# Altium schematic sheet TEMPLATE_Circuit.SchDoc
size Tabloid; Date: Date; Author: Author 1; Revision: 1; SheetNumber: 1; SheetTotal: 3; Size: 11x17; Sheet_Name: Circuit
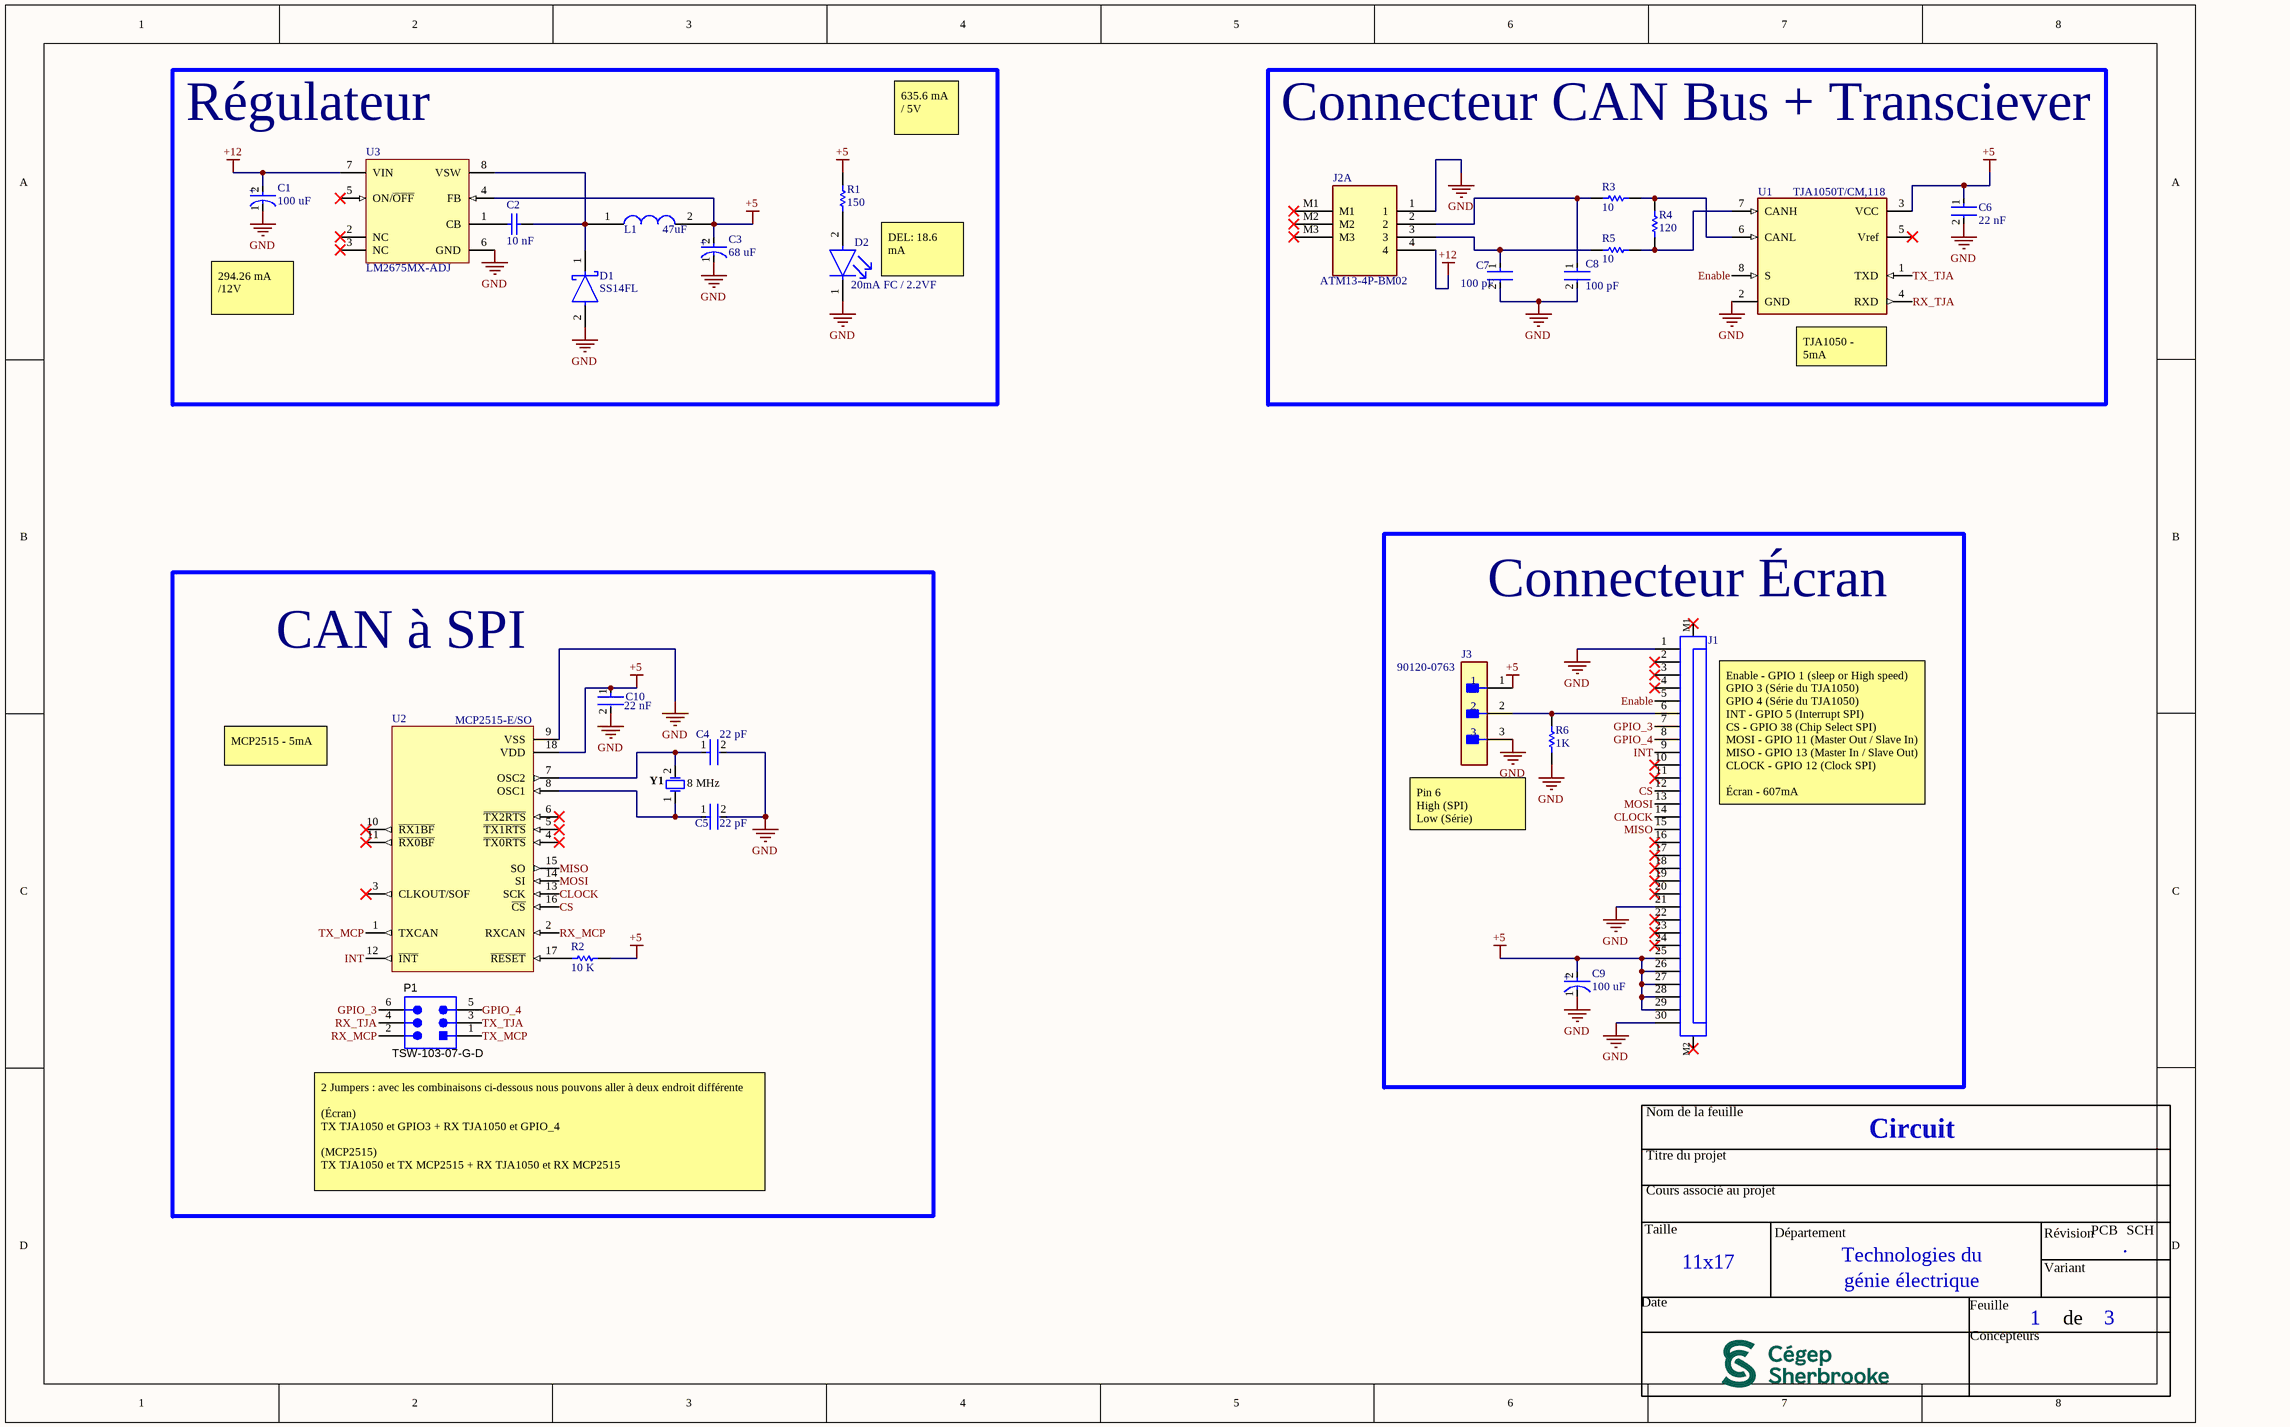
[diagram p0: TEMPLATE_Circuit.SchDoc]

## Parts
C1  100 uF  [FP-FKF-MFG]
C2  10 nF  [CAPC1608X90X35ML10T15]
C3  68 uF  [FP-OS-CON-SMT-F12-MFG]
C4  22 pF  [FP-C0805C-DN-MFG]
C5  22 pF  [FP-C0805C-DN-MFG]
C6  22 nF  [FP-C0805C-DN-MFG]
C7  100 pF  [FP-CC0805-0_1-0_7-IPC_A]
C8  100 pF  [FP-CC0805-0_1-0_7-IPC_A]
C9  100 uF  [FP-FKF-MFG]
C10  22 nF  [FP-C0805C-DN-MFG]
D1  SS14FL  [FP-425AD-MFG]
D2  20mA FC / 2.2VF  [FP-SML-210-MFG]
J1  68613014422  [68613014422]  (value not drawn)
J2  ATM13-4P-BM02  [ATM134PBM02]  (part A of 2)
J3  90120-0763  [FP-90120-0763-MFG]
L1  47uF  [NPI31W470MTRF]
P1  TSW-103-07-G-D  [SMTC-TSW-103-07-G-D_V]
R1  150  [RESC2013X60X40NL20T25]
R2  10 K  [RESC2013X60X35NL10T20]
R3  10  [RESC2013X50X30NL20T20]
R4  120  [RESC2013X60X40ML20T25]
R5  10  [RESC2013X50X30NL20T20]
R6  1K  [RESC2013X60X35ML10T20]
U1  TJA1050T/CM,118  [FP-SOT96-1-IPC_A]
U2  MCP2515-E/SO  [SOIC-SO18_M]
U3  LM2675MX-ADJ  [D0008A_N]
Y1  8 MHz  [FOX-HC49SDLF_V]

## Blocks framed on the sheet
Régulateur: C1-C3 D1 D2 L1 R1 U3
Connecteur CAN Bus + Transciever: C6-C8 J2 R3-R5 U1
Connecteur Écran: C9 J1 J3 R6
CAN à SPI: C4 C5 C10 P1 R2 U2 Y1

## Nets
+5: C3.2(A) C6.1 C9.2(A) C10.1 J1.25 J1.26 J1.27 J1.28 J1.29 J3.1 L1.2 R1.2 R2.2 U1.3(VCC) U2.18(VDD) U3.4(FB)
+12: C1.2(A) J2.4 U3.7(VIN)
GND: C1.1(C) C3.1(C) C4.2 C5.2 C6.2 C7.2 C8.2 C9.1(C) C10.2 D1.2(A) D2.1(C) J1.1 J1.21 J1.30 J2.1 J3.3 R6.1 U1.2(GND) U2.9(VSS) U3.6(GND)
CLOCK: J1.14 U2.13(SCK)
CS: J1.12 U2.16(~{CS})
Enable: J1.5 U1.8(S)
GPIO_3: J1.7 P1.6
GPIO_4: J1.8 P1.5
INT: J1.9 U2.12(~{INT})
MISO: J1.15 U2.15(SO)
MOSI: J1.13 U2.14(SI)
RX_MCP: P1.2 U2.2(RXCAN)
RX_TJA: P1.4 U1.4(RXD)
TX_MCP: P1.1 U2.1(TXCAN)
TX_TJA: P1.3 U1.1(TXD)
NetC2_1: C2.1 U3.1(CB)
NetC2_2: C2.2 D1.1(C) L1.1 U3.8(VSW)
NetC4_1: C4.1 U2.7(OSC2) Y1.2
NetC5_1: C5.1 U2.8(OSC1) Y1.1
NetC7_1: C7.1 J2.3 R5.1
NetC8_1: C8.1 J2.2 R3.1
NetD2_2: D2.2(A) R1.1
NetJ1_6: J1.6 J3.2 R6.2
NetR2_1: R2.1 U2.17(~{RESET})
NetR3_2: R3.2 R4.2 U1.6(CANL)
NetR4_1: R4.1 R5.2 U1.7(CANH)

Not connected (* = marked no-connect by the designer): J1 2* 3* 4* 10* 11* 16* 17* 18* 19* 20* 22* 23* 24* M1* M2*; J2 M1* M2* M3*; U1 5(Vref)*; U2 3(CLKOUT/SOF)* 4(~{TX0RTS})* 5(~{TX1RTS})* 6(~{TX2RTS})* 10(~{RX1BF})* 11(~{RX0BF})*; U3 2(NC)* 3(NC)* 5(ON/~{OFF})*

## Notes on the sheet
- 635.6 mA / 5V
- DEL: 18.6 mA
- 294.26 mA /12V
- (near U1) TJA1050 - 5mA
- MCP2515 - 5mA
- (near J1) Enable - GPIO 1 (sleep or High speed)
  GPIO 3 (Série du TJA1050)
  GPIO 4 (Série du TJA1050)
  INT - GPIO 5 (Interrupt SPI)
  CS - GPIO 38 (Chip Select SPI)
  MOSI - GPIO 11 (Master Out / Slave In)
  MISO - GPIO 13 (Master In / Slave Out)
  CLOCK - GPIO 12 (Clock SPI)
  Écran - 607mA
- Pin 6
  High (SPI)
  Low (Série)
- (near P1) 2 Jumpers : avec les combinaisons ci-dessous nous pouvons aller à deux endroit différente
  (Écran)
  TX TJA1050 et GPIO3 + RX TJA1050 et GPIO_4
  (MCP2515)
  TX TJA1050 et TX MCP2515 + RX TJA1050 et RX MCP2515
- Nom de la feuille
- Titre du projet
- Cours associé au projet
- Taille
- Département
- Technologies du
- Révision
- PCB
- .
- SCH
- Date
- génie électrique
- Feuille
- Variant
- de
- Concepteurs
- (in symbol CMP-2000-06208-3) +
- (in symbol CMP-05428-000631-1) +

## Library data of the parts
C1 C9 = CMP-2000-06208-3: CAP ALUM 100UF 20% 50V SMD; Leakage Current: 3uA; ESR (Equivalent Series Resistance): 340mR; Material: Aluminium; Ripple Current: 350mA; Life (Hours): 2000Hour; Min Operating Temperature: -55°C; Contact Plating: Tin; REACH SVHC: No SVHC; RoHS Compliant: Yes; Width: 10mm; Radiation Hardening: No; Termination: SMD/SMT; Packaging: Tape and Reel; Max Operating Temperature: 105°C; Case/Package: Radial; Voltage Rating: 50V; Length: 10.2mm; Voltage: 50V; Package Quantity: 1; Voltage Rating (DC): 50V; Height - Seated (Max): 0.402inch; Mount: Surface Mount; Impedance: 340mR; Construction: Cylindrical; Height: 10.2mm; Lead Free: Lead Free; Dielectric Material: Aluminium; Series: FK; Tolerance: 20%; Diameter: 8mm; Ripple Current (AC): 350mA; Capacitance: 100uF; Number of Pins: 2
C2 = CMP-2100-03642-1: Chip Capacitor, 10 nF, +/- 10%, 50 V, -55 to 125 degC, 0603 (1608 Metric), RoHS, Tape and Reel; Manufacturer: Murata; Insulation Resistance: 10GR; Dielectric: X7R; Voltage Rating: 50V; Capacitance: 10nF; Material: Ceramic; Package Quantity: 1; Lead Free: LeadFree; Case/Package: 0603; Termination: SMD/SMT; REACH SVHC: Unknown; Manufacturer URL: http://www.murata.com/; Datasheet URL: http://search.murata.co.jp/Ceramy/image/img/A01X/G101/ENG/GRM188R71H103KA01-01.pdf; Mount: SurfaceMount; Datasheet Version: 42401.0; Number of Pins: 2; Length: 1.6mm; Voltage: 50V; Depth: 0.8mm; Tolerance: 10%; Min Operating Temperature: -55degC; Voltage Rating (DC): 50V; Max Operating Temperature: 125degC; Package Description: 2-Pin Surface Mount Device, Body 1.6 x 0.8 mm; RoHSCompliant: True; Case Code (Imperial): 0603; Width: 0.031inch; Case Code (Metric): 1608; Height: 0.8mm; Package Reference: 0603; Packaging: TapeandReel; Thickness: 0.035inch; Dielectric Material: Ceramic
C3 = CMP-05428-000631-1: Conductive Polymer Aluminum Solid Capacitors (OS-CON) 68uF ±20% 50V RADIAL SMT 10x12.6mm; Leakage Current: 680uA; Life (Hours): 5000Hour; Dissipation Factor: 12%; Ripple Current (AC): 4.3A; ESR (Equivalent Series Resistance): 20mR; Polarity: Polar; Diameter: 10mm; Capacitance: 68uF; Min Operating Temperature: -55°C; Construction: Cylindrical; Tolerance: 20%; Voltage Rating: 50V; Case/Package: Radial; Mount: Surface Mount; Max Operating Temperature: 105°C; RoHS Compliant: Yes; Height - Seated (Max): 0.5inch; Termination: SMD/SMT; Voltage Rating (DC): 50V; Packaging: Tape and Reel; Length: 12.6mm; Package Quantity: 400; Number of Pins: 12; Lead Free: Lead Free; Height: 12.6mm; REACH SVHC: No SVHC; Ripple Current: 4.3A; Series: OS-CON™, SVPF; Voltage: 50V
C4 C5 = CMP-2007-00048-2: Capacitor; Ceramic; Cap; 22.0pF; Tol 5%; SMT; Vol-Rtg 50V; C0G; Tape and Reel; Manufacturer: KEMET; Manufacturer Part Number: C0805C220J5GACTU; Temperature Coefficient: 30ppm/°C; Tolerance: 0.05; Device Class L1: Passive Components; Mouser Description: Multilayer Ceramic Capacitors MLCC - SMD/SMT 50volts 22pF C0G 5%; Temperature Range Low: -55°C; Automotive: No; Voltage Rating: 50 V; Material: Ceramic; Category: Cap; Height: 0.88mm; Temperature Range High: +125°C; Capacitance: 22 pF; Digikey Description: Capacitor; Ceramic; Cap; 22.0pF; Tol 5%; SMT; Vol-Rtg 50V; C0G; Tape and Reel; Octopart: https://octopart.com/c0805c220j5gactu-kemet-145470; ComponentLink2Description: Datasheet; Device Class L2: Capacitors; Ipc Land Pattern Name: CAPC200125X78; Value: 22 pF; RoHS: TRUE; ComponentLink2URL: https://content.kemet.com/datasheets/KEM_C1003_C0G_SMD.pdf; Temperature: -55°C to +125°C; Device Class L3: Ceramic Capacitors; Lead Free: Yes; Temperature Characteristic: C0G; Package: C0805C-DN
C6 C10 = CMP-2007-00338-2: CAP CER 0.022UF 50V X7R 0805; Manufacturer: KEMET; Manufacturer Part Number: C0805C223K5RACTU; Value: 22,000 pF; Material: Ceramic; Tolerance: 0.1; Temperature Coefficient: 30ppm/°C; Automotive: No; Package: C0805C-DN; RoHS: TRUE; Height: 0.88mm; Lead Free: Yes; Temperature Range Low: -55°C; Digikey Description: CAP CER 0.022UF 50V X7R 0805; ComponentLink2Description: Datasheet; Capacitance: 22,000 pF; Mouser Description: Capacitor; Ceramic; Cap; .022uF; Tol 10%; SMT; Vol-Rtg 50V; X7R; Tape and Reel; Device Class L3: Ceramic Capacitors; Category: Cap; Voltage Rating: 50 V; Temperature Characteristic: X7R; Ipc Land Pattern Name: CAPC200125X78; Octopart: https://octopart.com/c0805c223k5ractu-kemet-145968; Device Class L1: Passive Components; Temperature: -55°C to +125°C; ComponentLink2URL: https://content.kemet.com/datasheets/KEM_C1003_C0G_SMD.pdf; Temperature Range High: +125°C; Device Class L2: Capacitors
C7 C8 = CMP-03422-001508-1: CAP CER 100PF 50V C0G/NPO 0805; Insulation Resistance: 100GR; Dielectric: C0G; Temperature Coefficient: 30ppm/°C; Dielectric Material: Ceramic; Tolerance: 5%; REACH SVHC: No SVHC; Packaging: Tape and Reel; Max Operating Temperature: 125°C; Case Code (Imperial): 0805; Number of Pins: 2; Height: 0.6mm; Case/Package: 0805; Resistor Type: Ceramic; Length: 2mm; Width: 1.25mm; RoHS Compliant: Yes; Thickness: 0.024inch; Case Code (Metric): 2012; Radiation Hardening: No; Series: CC; Package Quantity: 1; Voltage: 50V; Voltage Rating (DC): 50V; Capacitance: 100pF; Mount: Surface Mount; Voltage Rating: 50V; Min Operating Temperature: -55°C; Lead Free: Lead Free; Termination: SMD/SMT; Depth: 1.25mm
D1 = CMP-07162-000013-1: DIODE SCHOTTKY 40V 1A SOD123F; Manufacturer: ON Semiconductor; Max Junction Temp: +125°C; Value: 60pF; Max Surge Forward Current: 40A; Peak Reverse Current: 30uA; Device Class L3: Schottky Diodes; Reverse Voltage: 40V; Automotive: No; Temperature: -55°C to +125°C; Mouser Description: SS14FL Series 40 V 1 A Surface Mount Schottky Barrier Rectifier - SOD-123F; Octopart: https://octopart.com/ss14fl-on+semiconductor-84331601; Height: 1.08mm; Temperature Range Low: -55°C; Category: Diode; Lead Free: Yes; Device Class L1: Discrete Semiconductors; Digikey Description: DIODE SCHOTTKY 40V 1A SOD123F; RoHS: TRUE; ComponentLink2Description: Datasheet; Manufacturer Part Number: SS14FL; Forward Current: 1A; Capacitance: 60pF; Package: 425AD; Device Class L2: Diodes; Temperature Range High: +125°C; Max Repetitive Reverse Voltage: 40V; ComponentLink2URL: https://www.onsemi.com/pub/Collateral/SS14FL-D.PDF
D2 = CMP-08952-000013-1: LED GREEN CLEAR 0805 SMD; Manufacturer Part Number: SML-210MTT86; Manufacturer: ROHM; Reverse Voltage: 4V; Peak Emmision Wavelength: 573nm; Forward Voltage: 2.2V; Luminous Intensity: 16mcd; Power Dissipation: 70mW; Led Orientation: Top View; Wavelength: 570nm; Device Class L2: LEDs; Colour: Green; Forward Current: 20mA; Height: 0.90mm; Ipc Land Pattern Name: DIOCP200125X25; Automotive: No; Temperature Range High: +85°C; Device Class L3: unset; Temperature: -30°C to +85°C; Device Class L1: Optoelectronics; Mouser Description: Standard LEDs - SMD GREEN SMD TRANS LENS; Temperature Range Low: -30°C; Package: SML-210; Digikey Description: LED GREEN CLEAR 0805 SMD; Lead Free: Yes; ComponentLink2URL: https://www.mouser.in/ds/2/348/sml-21-313092.pdf; ComponentLink2Description: Datasheet; Octopart: https://octopart.com/sml-210mtt86-rohm-550711; RoHS: TRUE; Category: Diode
J1 = CMP-1502-01467-2: NexarPartId: 22802282; Number of Contacts: 30; Insulation Resistance: 100MΩ; Operating Supply Voltage: 125V; Contact Resistance: 20mΩ; Actuator Material: Polyphenylene; Pitch: 1mm; Gender: Receptacle; Current Rating: 1A; RoHS: Compliant; Contact Material: Bronze, Tin; Housing Material: Polyphenylene; Max Operating Temperature: 85°C; Flammability Rating: UL94 V-0; REACH SVHC: Unknown; Min Operating Temperature: -25°C; Number of Rows: 1; Lead Pitch: 1mm; Length: 37mm; Packaging: Tape and Reel; Width: 3mm; Voltage Rating: 125V; Contact Plating: Tin; Number of Pins: 30; Mount: Surface Mount; Orientation: Horizontal; Termination: Solder; Number of Positions: 30
J3 = CMP-04776-000084-1: CONN HEADER VERT 3POS 2.54MM; Manufacturer: Molex; Voltage Rating: 350V; Number Of Contacts: 3; Conn Orientation: Vertical; Current Rating: 3A; Conn Gender: Male; Package: 90120-0763; ComponentLink2Description: Datasheet; Height: 5.8mm; Manufacturer Part Number: 90120-0763; Temperature Range High: +125°C; RoHS: TRUE; ComponentLink2URL: https://www.molex.com/webdocs/datasheets/pdf/en-us/0901200763_PCB_HEADERS.pdf; Device Class L2: Headers and Wire Housings; Temperature: -55°C to +125°C; Device Class L1: Connectors; Pitch: 2.54mm; Footprint Url: https://www.molex.com/pdm_docs/sd/901200763_sd.pdf; Device Class L3: unset; Temperature Range Low: -55°C; Number Of Rows: 1; Category: Conn; Lead Free: Yes; Mouser Description: Board-To-Board Connector, C-Grid III 90120 Series, Through Hole, Header, 3, 2.54 mm; Octopart: https://octopart.com/90120-0763-molex-655433; Contact Material: Gold,Nickel; Automotive: No; Digikey Description: CONN HEADER VERT 3POS 2.54MM
L1 = TEMPLATE_Circuit
P1 = CMP-2000-07329-1: Through Hole Header, Pitch 2.54 mm, 2 x 3 Position, Height 8.58 mm, Tail Length 2.54 mm, -55 to 125 degC, RoHS, Bulk; Manufacturer: Samtec-Inc.; Number of Positions Loaded: All; Number of Positions: 6; Row Spacing: 0.100"(2.54mm); Connector Type: Header,Unshrouded; Package Reference: TSW-103-07-G-D; Termination: Solder; Manufacturer URL: http://www.samtec.com/; Contact Finish: Gold; Contact Mating Length: 0.230"(5.84mm); Package Description: Through Hole Header, Pitch 2.54 mm, 2 x 3 Position, Height 8.58 mm, Tail Length 2.54 mm; Datasheet Version: 12/2015; Number of Rows: 2; Features: -; Family: RectangularConnectors-Headers,MalePins; Fastening Type: -; Datasheet URL: http://suddendocs.samtec.com/catalog_english/tsw_th.pdf; Category: Connectors,Interconnects; Package URL: http://suddendocs.samtec.com/prints/tsw-xxx-xx-xxx-x-xx-xxx-mkt.pdf; Mounting Type: ThroughHole; Contact Finish Thickness: 10µin(0.25µm); Packaging: Bulk; Color: Black; Pitch: 0.100"(2.54mm); Series: TSW; Contact Type: MalePin; Mounting Technology: ThroughHole
R1 = CMP-2001-00596-1: Manufacturer: Panasonic; Part Number: ERA6AEB151V
R2 = CMP-1659-00013-4: Chip Resistor, 10 KOhm, +/- 1%, 0.125 W, -55 to 155 degC, 0805 (2012 Metric), RoHS, Tape and Reel; Manufacturer: Yageo; Voltage Rating: 150 V; Mount: Surface Mount; ComponentLink1Description: Manufacturer URL; ComponentLink2URL: http://www.yageo.com/documents/recent/PYu-RC_Group_51_RoHS_L_04.pdf; Pins: 2; Length: 2 mm; Min Operating Temperature: -55 degC; Height: 0.5 mm; Mounting Technology: Surface Mount; RoHSCompliant: true; REACH SVHC: No SVHC; ComponentLink1URL: http://www.yageo.com/; Max Operating Temperature: 155 degC; PackageReference: 0805; DatasheetVersion: Rev. 4, 02/2016; Package Quantity: 5000; Packaging: Tape and Reel; ComponentLink2Description: Datasheet; PackageDescription: 2-Pin Surface Mounted Device, Body 2 x 1.25 mm
R3 R5 = CMP-2001-04915-1: Manufacturer: Vishay Dale; Part Number: CRCW080510R0FKEA
R4 = CMP-2001-00588-1: Manufacturer: Panasonic; Part Number: ERA6AEB121V
R6 = CMP-2100-03671-1: Chip Resistor, 1 KOhm, +/- 1%, 125 mW, -55 to 155 degC, 0805 (2012 Metric), RoHS, Tape and Reel; Manufacturer: Yageo; Temperature Coefficient: 100ppm/degreesC; Voltage Rating (DC): 150V; Max Power Dissipation: 125mW; Resistance: 1KOhm; Number of Pins: 2; Number of Terminations: 2; Datasheet URL: http://www.yageo.com/NewPortal/yageodocoutput?fileName=/pdf/R-Chip/PYu-RC_Group_51_RoHS_L_5.pdf; Length: 0.079inch; Package Description: 2-Pin Surface Mounted Device, Body 2 x 1.25 mm; Depth: 1.25mm; Height: 0.024inch; Military Standard: Not; Case/Package: 0805; Package Reference: 0805; RoHSCompliant: true; Lead Free: LeadFree; Packaging: TapeandReel; Package Quantity: 1; Datasheet Version: Rev. 5, 10/2016; Tolerance: 1%; Min Operating Temperature: -55degC; Voltage Rating: 150V; Composition: ThickFilm; Case Code (Imperial): 0805; Power Rating: 125mW; Width: 0.049inch; Case Code (Metric): 2012; Manufacturer URL: http://www.yageo.com/; Max Operating Temperature: 155degC; REACH SVHC: Unknown; Termination: SMD/SMT
U1 = CMP-2000-04923-2: IC TRANSCEIVER HALF 1/1 8SO; Simplex/Duplex: Half Duplex; Max Supply Current: 10mA; Number of Receive Buffers: 1; Min Supply Voltage: 4.75V; Max Supply Voltage: 5.25V; Interface: CAN; Data Rate: 1Mbps; Receiver Hysteresis: 70mV; Number of Transmit Buffers: 1; Min Operating Temperature: -40°C; Case/Package: SO; REACH SVHC: No SVHC; Max Operating Temperature: 150°C; Number of Pins: 8; Lead Free: Lead Free; Number of Transceivers: 1; Packaging: Tape and Reel; Mount: Surface Mount; Radiation Hardening: No; Nominal Supply Current: 10mA; Package Quantity: 2500; Contact Plating: Gold
U2 = CMP-0186-00035-2: Stand-Alone CAN Controller With SPI Interface, 18-Pin SOIC, Extended Temperature; RevisionNote: URLs added. DatasheetVersion updated.; DatasheetVersion: revF, Oct-2010; ComponentLink2Description: Datasheet; ComponentLink3Description: Package Specification; ComponentLink1Description: Manufacturer URL; PackageReference: SOIC-SO18; PackageDescription: 18-Lead Plastic Small Outline (SO) - Wide 7.50mm Body [SOIC]; PackageVersion: revBB, Aug-2009; ComponentLink1URL: http://www.microchip.com/; ComponentLink3URL: http://www.microchip.com/stellent/groups/techpub_sg/documents/packagingspec/en012702.pdf; ComponentLink2URL: http://ww1.microchip.com/downloads/en/DeviceDoc/21801f.pdf; Code_JEDEC: MS-013
U3 = CMP-0069-00674-3: SIMPLE SWITCHER® Power Converter High Efficiency 1A Step-Down Voltage Regulator, 8-pin Narrow SOIC; Manufacturer: Texas Instruments; PowerWise: N; PackageTopMarking: NSZXTT*2675*MADJ; Code_IPC: SOIC127P600-8; PackageDescription: SOIC Narrow, 4.9 x 3.9 x 1.45mm, 8 Lead, 1.27mm Pitch; ComponentLink1URL: http://www.ti.com/general/docs/lit/getliterature.tsp?genericPartNumber=LM2675&fileType=pdf; PackageReference: D0008A; CompType: Switcher; RoHS: N; ComponentLink1Description: Datasheet URL; PinCount: 8; Code_JEDEC: MS-012-AA
Y1 = CMP-2100-03639-1: Resistance Weld Crystal, 8 MHz, +/- 30 ppm, -20 to 70 degC, 2-Pin SMD, RoHS, Tape and Reel; Manufacturer: FOX Electronics; Series Resistance: 80Ohm; Frequency: 8MHz; Load Capacitance: 20pF; Tolerance: 50ppm; Frequency Tolerance: 30ppm; Datasheet URL: http://www.foxonline.com/pdfs/hc49sdlf.pdf; Package Reference: HC49SDLF; Height: 4.5mm; Mount: SurfaceMount; Packaging: TapeandReel; Length: 11.7mm; Termination: SMD/SMT; Number of Pins: 2; Depth: 5mm; Min Operating Temperature: -20degC; Package Quantity: 1000; RoHSCompliant: True; Lead Free: LeadFree; Width: 5mm; Case/Package: SMD/SMT; Manufacturer URL: http://www.foxonline.com/; Max Operating Temperature: 70degC; REACH SVHC: NoSVHC; Datasheet Version: 42064.0; Package Description: 2-Pin Surface Mount Device, Body 5 x 11.7 mm; Frequency Stability: 50ppm; ESR (Equivalent Series Resistance): 80Ohm; Radiation Hardening: No